# Altium schematic sheet Stamp-C5.SchDoc
size A4; SheetNumber: 3; SheetTotal: 3
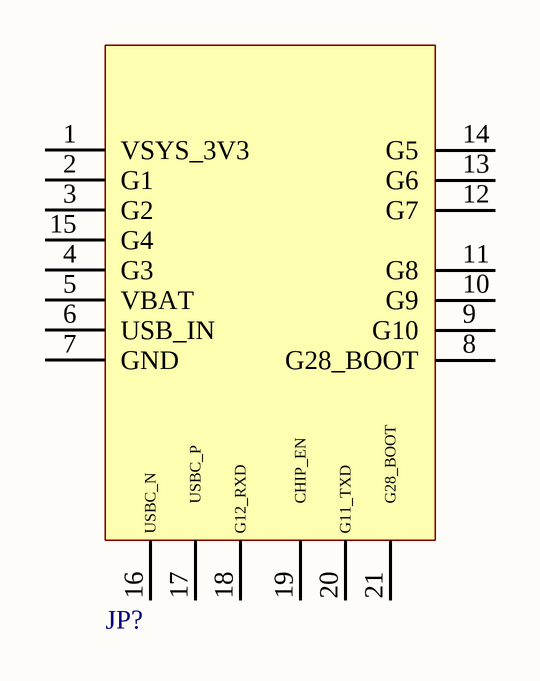
[diagram p0: Stamp-C5.SchDoc]

## Parts
JP?  STAMP_C5-2X7  [STAMP_C5]  (value not drawn)

## Nets

Not connected (* = marked no-connect by the designer): JP? 1(VSYS_3V3) 2(G1) 3(G2) 4(G3) 5(VBAT) 6(USB_IN) 7(GND) 8(G28_BOOT) 9(G10) 10(G9) 11(G8) 12(G7) 13(G6) 14(G5) 15(G4) 16(USBC_N) 17(USBC_P) 18(G12_RXD) 19(CHIP_EN) 20(G11_TXD) 21(G28_BOOT)

## Library data of the parts
JP? = STAMP_C5: 封装库来自淘宝卖家 ID：黄晶宝石: 其他店铺购入均为盗版，不享受售后技术支持服务，请立即申请退款